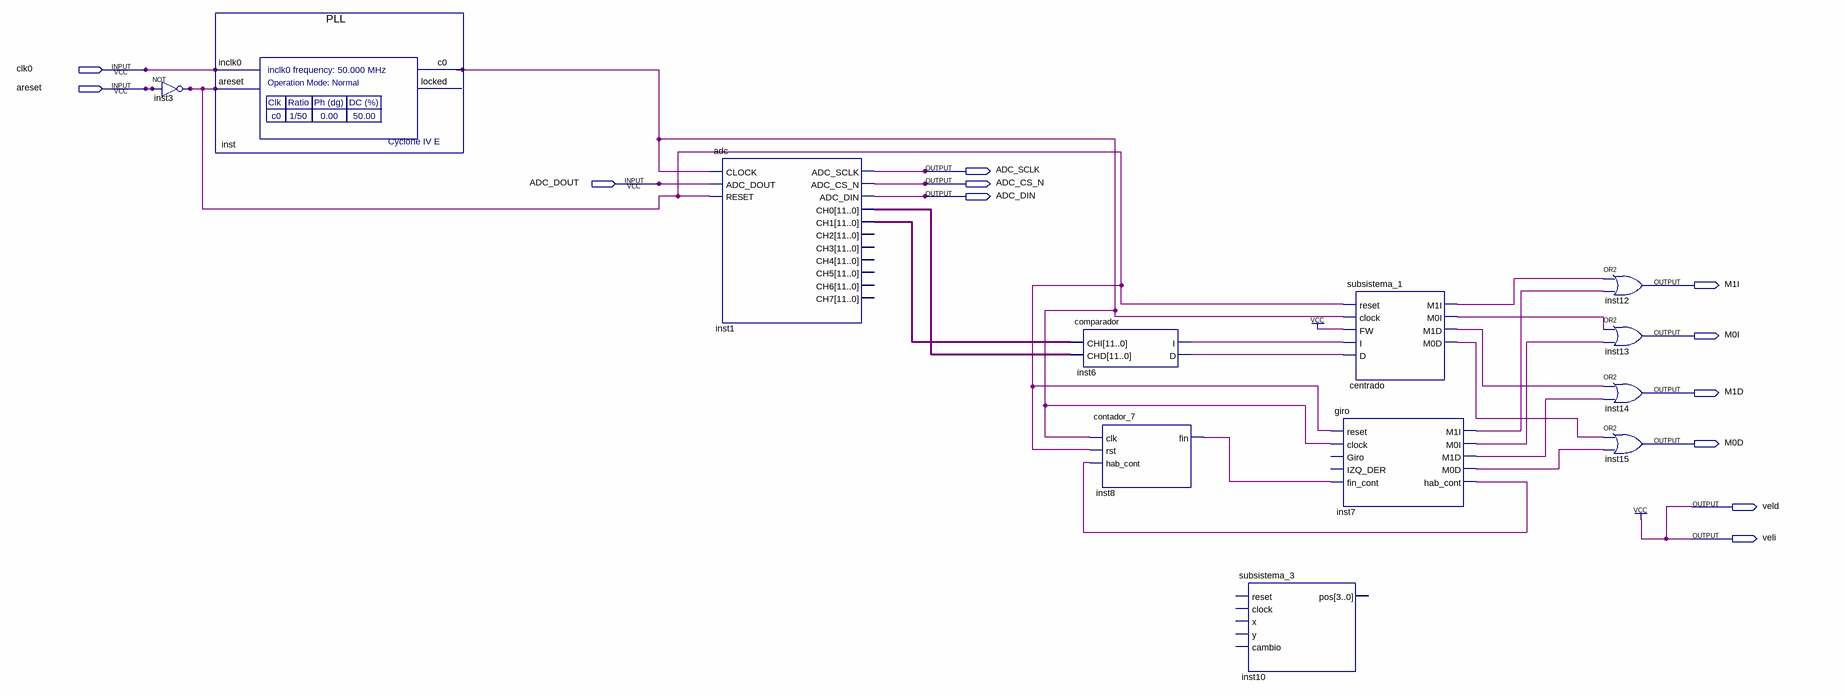
[diagram p0: schematic sheet]
// Quartus schematic ADC_tutorialV2.bdf as structural Verilog: 12 symbols, 12 pins
module ADC_tutorialV2 (
  input  clk0,
  input  areset,
  input  ADC_DOUT,
  output ADC_SCLK,
  output ADC_CS_N,
  output ADC_DIN,
  output M1I,
  output M0I,
  output M1D,
  output M0D,
  output veld,
  output veli
);

  wire centrado_m0d, centrado_m0i, centrado_m1d, centrado_m1i, inst3_out, inst6_d, inst6_i, inst7_hab_cont,
       inst7_m0d, inst7_m0i, inst7_m1d, inst7_m1i, inst8_fin, inst_c0;
  wire [11:0] inst1_ch0, inst1_ch1;

  not inst3 (inst3_out, areset);
  PLL inst (.inclk0(clk0), .areset(inst3_out), .c0(inst_c0));  // open: locked
  adc inst1 (
    .CLOCK(inst_c0), .ADC_DOUT(ADC_DOUT), .RESET(inst3_out), .ADC_SCLK(ADC_SCLK), .ADC_CS_N(ADC_CS_N),
    .ADC_DIN(ADC_DIN), .CH0(inst1_ch0), .CH1(inst1_ch1));  // open: CH2, CH3, CH4, CH5, CH6, CH7
  comparador inst6 (.CHI(inst1_ch1), .CHD(inst1_ch0), .I(inst6_i), .D(inst6_d));
  contador_7 inst8 (.clk(inst_c0), .rst(inst3_out), .hab_cont(inst7_hab_cont), .fin(inst8_fin));
  subsistema_3 inst10 ();  // open: reset, clock, x, y, cambio, pos
  subsistema_1 centrado (
    .reset(inst3_out), .clock(inst_c0), .FW(1'b1), .I(inst6_i), .D(inst6_d), .M1I(centrado_m1i),
    .M0I(centrado_m0i), .M1D(centrado_m1d), .M0D(centrado_m0d));
  giro inst7 (
    .reset(inst3_out), .clock(inst_c0), .fin_cont(inst8_fin), .M1I(inst7_m1i), .M0I(inst7_m0i),
    .M1D(inst7_m1d), .M0D(inst7_m0d), .hab_cont(inst7_hab_cont));  // open: Giro, IZQ_DER
  or inst12 (M1I, centrado_m1i, inst7_m1i);
  or inst13 (M0I, centrado_m0i, inst7_m0i);
  or inst14 (M1D, centrado_m1d, inst7_m1d);
  or inst15 (M0D, centrado_m0d, inst7_m0d);

  assign veld = 1'b1;
  assign veli = 1'b1;
endmodule
